# EasyEDA Pro project ADC前端电路.eprj

# Schematic Schematic1_2
Create Date: 2024-07-14; Page Name: P1; Project Name: ADC前端电路; Schematic Name: Schematic1_2; Update Date: 2024-08-06; Company: 嘉立创EDA; Page Size: A4; Version: V1.0
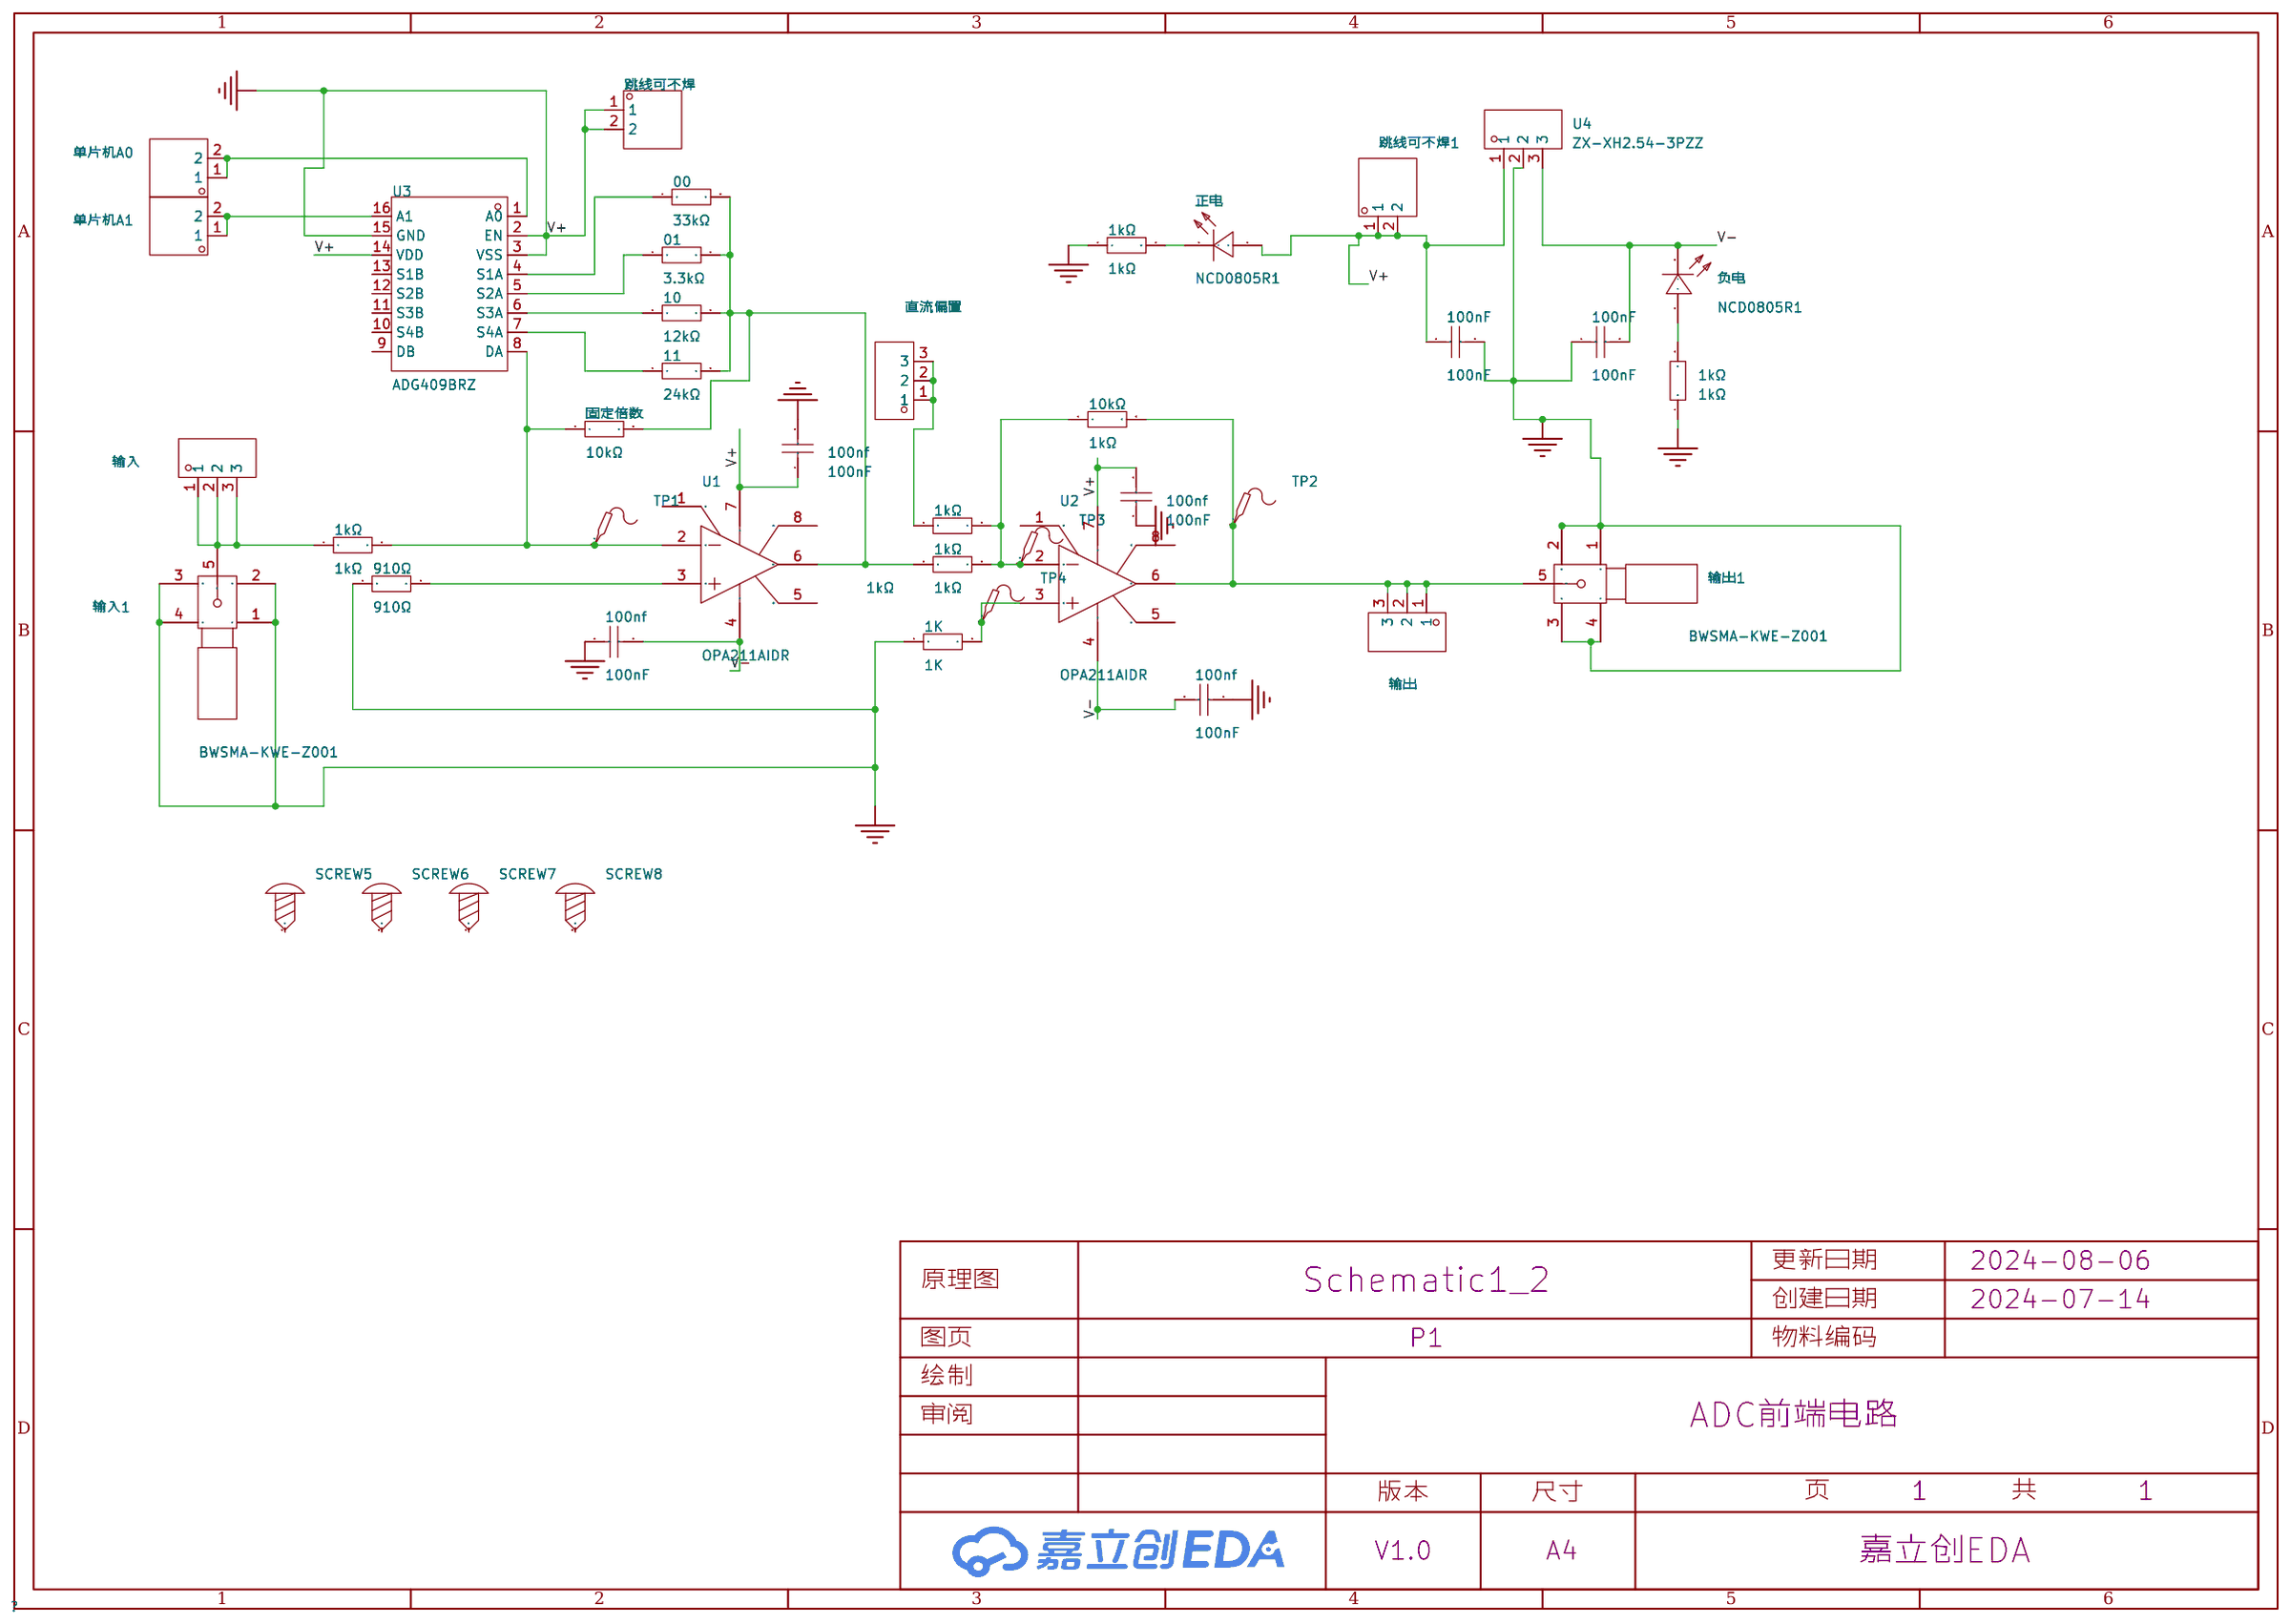
[diagram p0: schematic sheet]

## Parts
00  33kΩ  [R0805]
01  3.3kΩ  [R0805]
1K  1K  [R0805]
1kΩ  1kΩ  [R0805]
1kΩ#2  1kΩ  [R0805]
1kΩ#3  1kΩ  [Res_1/8W]
1kΩ#4  1kΩ  [R0805]
1kΩ#5  1kΩ  [R0805]
10  12kΩ  [R0805]
10kΩ  1kΩ  [Res_1/8W]
11  24kΩ  [R0805]
100nF  100nF  [C0805]
100nf  100nF  [C0805]
100nF#2  100nF  [C0805]
100nf#2  100nF  [C0805]
100nf#3  100nF  [C0805]
100nf#4  100nF  [C0805]
910Ω  910Ω  [R0805]
SCREW5  -  [M3螺丝]
SCREW6  -  [M3螺丝]
SCREW7  -  [M3螺丝]
SCREW8  -  [M3螺丝]
TP1  -  [Test-Point-0.5mm]
TP2  -  [Test-Point-0.5mm]
TP3  -  [Test-Point-0.5mm]
TP4  -  [Test-Point-0.5mm]
U1  OPA211AIDR  [SOIC-8_L4.9-W3.9-P1.27-LS6.0-BL]
U2  OPA211AIDR  [SOIC-8_L4.9-W3.9-P1.27-LS6.0-BL]
U3  ADG409BRZ  [SOIC-16_L9.9-W3.9-P1.27-LS6.0-BL]
U4  ZX-XH2.54-3PZZ  [CONN-TH_3P-P2.54_2501S-3P]
单片机A0  -  [HDR-TH_2P-P2.54-V-M-1]
单片机A1  -  [HDR-TH_2P-P2.54-V-M-1]
固定倍数  10kΩ  [R0805]
正电  NCD0805R1  [LED0805-R-RD]
直流偏置  -  [HDR-TH_3P-P2.54-V-M]
负电  NCD0805R1  [LED0805-R-RD]
跳线可不焊  -  [HDR-TH_2P-P2.54-V-M-1]
跳线可不焊1  -  [HDR-TH_2P-P2.54-V-M-1]
输入  -  [HDR-TH_3P-P2.54-V-F]
输入1  BWSMA-KWE-Z001  [SMA-TH_BWSMA-KWE-Z001]
输出  -  [HDR-TH_3P-P2.54-V-F]
输出1  BWSMA-KWE-Z001  [SMA-TH_BWSMA-KWE-Z001]

## Library data of the parts
00 01 1kΩ 1kΩ#2 1kΩ#4 1kΩ#5 10 11 910Ω 固定倍数 = 0805W8F1002T5E_C17414: 电阻类型:厚膜电阻;阻值:10kΩ;精度:±1%;功率:125mW;最大工作电压:150V;温度系数:±100ppm/℃;; LCSC Part Name: 10kΩ ±1% 125mW 厚膜电阻; Supplier Part: C17414; Manufacturer: UNI-ROYAL(厚声); Manufacturer Part: 0805W8F1002T5E; Supplier Footprint: 0805; JLCPCB Part Class: Basic Part; Datasheet: https://atta.szlcsc.com/upload/public/pdf/source/20200306/C422600_1E6D84923E4A46A82E41ADD87F860B5C.pdf; Supplier: LCSC; Type: 厚膜电阻; Tolerance: ±1%; Power(Watts): 125mW; Overload Voltage (Max): 150V; Temperature Coefficient: ±100ppm/℃; Operating Temperature Range: -55℃~+155℃
1K = Res_0805: Supplier Footprint: 0805
1kΩ#3 10kΩ = Res_AXIAL-1/8W: Supplier Footprint: 轴向引线
100nF 100nf 100nF#2 100nf#2-100nf#4 = CC0805KRX7R9BB104: 容值:100nF;精度:±10%;额定电压:50V;材质(温度系数):X7R;; LCSC Part Name: 100nF ±10% 50V; Supplier Part: C49678; Manufacturer: YAGEO(国巨); Supplier Footprint: 0805; JLCPCB Part Class: 基础库; Datasheet: https://atta.szlcsc.com/upload/public/pdf/source/20180224/C181747_15194369449651363981.pdf; Supplier: LCSC; Tolerance: ±10%; Voltage Rated: 50V; Temperature Coefficient: X7R
SCREW5-SCREW8 = M3螺丝: Supplier Footprint: 插件
TP1-TP4 = Test-Point: Test Point 测试点
U1 U2 = OPA211AIDR: 放大器数:单路;增益带宽积(GBP):80MHz;输入偏置电流(Ib):60nA;压摆率(SR):27V/us;轨到轨:-;; Supplier Part: C523992; Manufacturer: TI(德州仪器); Supplier Footprint: SOIC-8; JLCPCB Part Class: 扩展库; Datasheet: https://www.ti.com/cn/lit/gpn/opa211; Supplier: LCSC; Number of Circuits: 单路; Gain Bandwidth Product(GBP): 80MHz; Current - Input Bias(Ib): 60nA; Slew Rate(SR): 27V/us; Output Current: 30mA; Operating Temperature: -40℃~+125℃
U3 = ADG409BRZ: 开关电路:单刀四掷(SP4T);通道数:2;导通电阻(Ron@VCC):100Ω;; Supplier Part: C209414; Manufacturer: ADI(亚德诺); Supplier Footprint: SOIC-16; JLCPCB Part Class: 扩展库; Datasheet: https://atta.szlcsc.com/upload/public/pdf/source/20190819/C391265_7868ADE2F7ECF1D266CA16051ABDB450.pdf; Supplier: LCSC; Switch Circuit: 单刀四掷(SP4T); Number of Channels: 2; Supply Voltage: 12V; On-State Resistance (Max): 100Ω
U4 = ZX-XH2.54-3PZZ: 插针结构:1x3P;间距:2.54mm;安装方式:直插;参考系列:XH;总PIN数:3P;排数:1;每排PIN数:3;行距:-;额定电流:3A;触头材质:黄铜;触头镀层:锡;工作温度范围:-25℃~+85℃;; Supplier Part: C7429633; Manufacturer: Megastar(兆星); Supplier Footprint: 插件,P=2.54mm; JLCPCB Part Class: 扩展库; Datasheet: https://atta.szlcsc.com/upload/public/pdf/source/20230619/AE17037A2CFDBE8D9CBA775D61AD0A84.pdf; Supplier: LCSC; Pins Structure: 1x3P; Pitch: 2.54mm; Mounting Style: 直插; Reference Series: XH; Number of Pins: 3P; Number of Rows: 1; Number of PINs Per Row: 3; Current Rating (Max): 3A; Contact Material: 黄铜; Contact Plating: 锡; Operating Temperature Range: -25℃~+85℃
单片机A0 单片机A1 跳线可不焊 跳线可不焊1 = HDR-M_2.54_1x2P: Supplier Part: C124375; Supplier Footprint: 插件
正电 负电 = NCD0805R1: 灯头类型:-;发光颜色:红色;正向电压(VF):1.6V~2.6V;功率:65mW;正向电流:20mA;主波长:615nm~630nm;二极管配置:独立二极管;透镜颜色:无色透明透镜;色温:-;发光强度:67mcd~195mcd;发光角度:130°;载带方式:-;工作温度:-30℃~+85℃;; Supplier Part: C84256; Manufacturer: 国星光电; Supplier Footprint: 0805; JLCPCB Part Class: Basic Part; Datasheet: https://atta.szlcsc.com/upload/public/pdf/source/20200820/C84256_F0A75A43B3EAD75808600A0514C76B99.pdf; Supplier: LCSC; Emitted Color: 红色; Forward Voltage (VF): 1.6V~2.6V; Power Dissipation: 65mW; Forward Current: 20mA; Dominant Wavelength: 615nm~630nm; Diode Configuration: 独立二极管; Lens Color: 无色透明透镜; Luminous Intensity: 67mcd~195mcd; Viewing Angle: 130°; Operating Temperature: -30℃~+85℃
直流偏置 = HDR-M_2.54_1x3P: Supplier Part: C2937625; Supplier Footprint: 插件
输入 输出 = HDR-F_2.54_1x3P: Supplier Part: C541850; Supplier Footprint: 插件
输入1 输出1 = BWSMA-KWE-Z001: 连接器类型:板端;接口类型:内孔;端口数量:1;接口直径:5.3mm;接口长度/高度:-;频率-最大值:-;射频系列:SMA;阻抗:50Ω;样式:弯头;触头材质:-;触头镀层:-;工作温度范围:-;焊接温度(最大值):-;; LCSC Part Name: 内孔 SMA 弯头; Supplier Part: C496551; Manufacturer: BAT WIRELESS(蝙蝠无线); Supplier Footprint: 插件; JLCPCB Part Class: 扩展库; Datasheet: https://atta.szlcsc.com/upload/public/pdf/source/20231017/997A8C2ADA7F8034A89BE1264F38CE52.pdf; Supplier: LCSC; Connector Type: 板端; Interface Type: 内孔; Number of Ports: 1; Interface Diameter: 5.3mm; RF Series: SMA; Impedance: 50Ω; Style: 弯头

## Nets
GND: 1K.1 1kΩ#4.1 1kΩ#5.1 100nf.1 100nF.2 100nF#2.1 100nf#2.1 100nf#3.2 100nf#4.2 910Ω.1 U3.3(VSS) U3.15(GND) U4.2 输入1.1 输入1.2 输入1.3 输入1.4 输出1.1 输出1.2 输出1.3 输出1.4
V+: 100nF.1 100nf.2 100nf#3.1 U1.7(V+) U2.7(V+) U3.2(EN) U3.14(VDD) U4.1 正电.1(+) 跳线可不焊.1 跳线可不焊.2 跳线可不焊1.1 跳线可不焊1.2
V-: 100nF#2.2 100nf#2.2 100nf#4.1 U1.4(V-) U2.4(V-) U4.3 负电.2(-)
$1N586: 00.1 U3.4(S1A)
$1N606: 01.1 U3.5(S2A)
$1N610: 10.1 U3.6(S3A)
$1N616: 11.1 U3.7(S4A)
$1N704: 910Ω.2 U1.3(IN+)
$1N929: 1K.2 TP4.1 U2.3(IN+)
$1N2671: U3.1(A0) 单片机A0.1 单片机A0.2
$1N2676: U3.16(A1) 单片机A1.1 单片机A1.2
$1N3075: 10kΩ.2 TP2.1 U2.6(OUT) 输出.1 输出.2 输出.3 输出1.5
Net-(00-2): 00.2 01.2 1kΩ#3.1 10.2 11.2 U1.6(OUT) 固定倍数.2
Net-(1kΩ#2-1): 1kΩ#2.1 直流偏置.1 直流偏置.2 直流偏置.3
Net-(1kΩ#2-2): 1kΩ#2.2 1kΩ#3.2 10kΩ.1 TP3.1 U2.2(IN-)
Net-(1kΩ#4-2): 1kΩ#4.2 正电.2(-)
Net-(1kΩ#5-2): 1kΩ#5.2 负电.1(+)
Net-(1kΩ-1): 1kΩ.1 输入.1 输入.2 输入.3 输入1.5
Net-(1kΩ-2): 1kΩ.2 TP1.1 U1.2(IN-) U3.8(DA) 固定倍数.1

Not connected (* = marked no-connect by the designer): SCREW5 1; SCREW6 1; SCREW7 1; SCREW8 1; U1 1(NC) 5(NC) 8(NC); U2 1(NC) 5(NC) 8(NC); U3 9(DB) 10(S4B) 11(S3B) 12(S2B) 13(S1B)

# Board PCB1_2
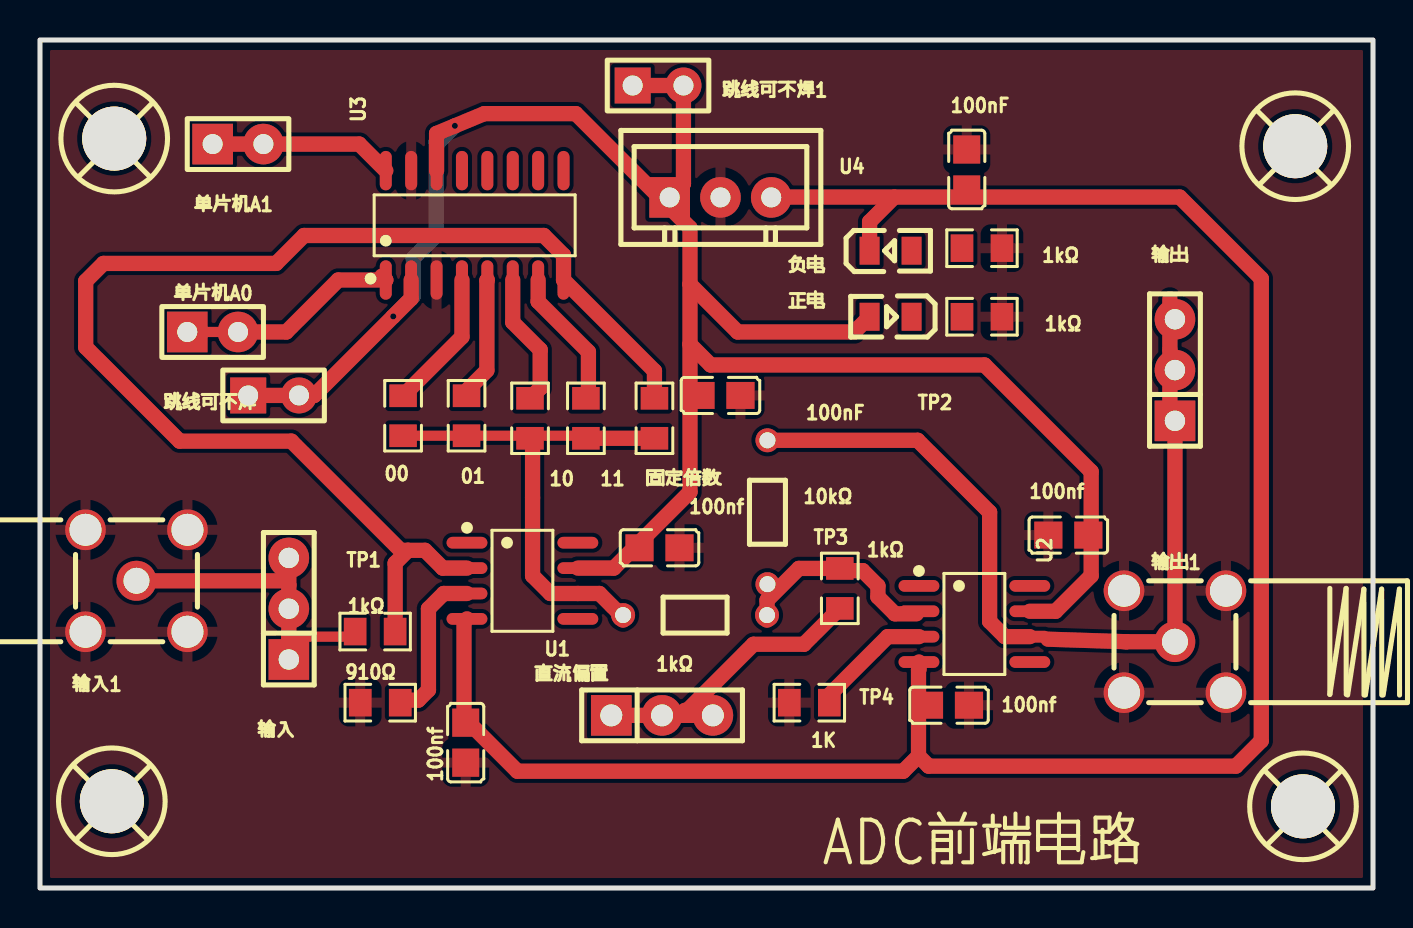
[diagram p1: board, top side]
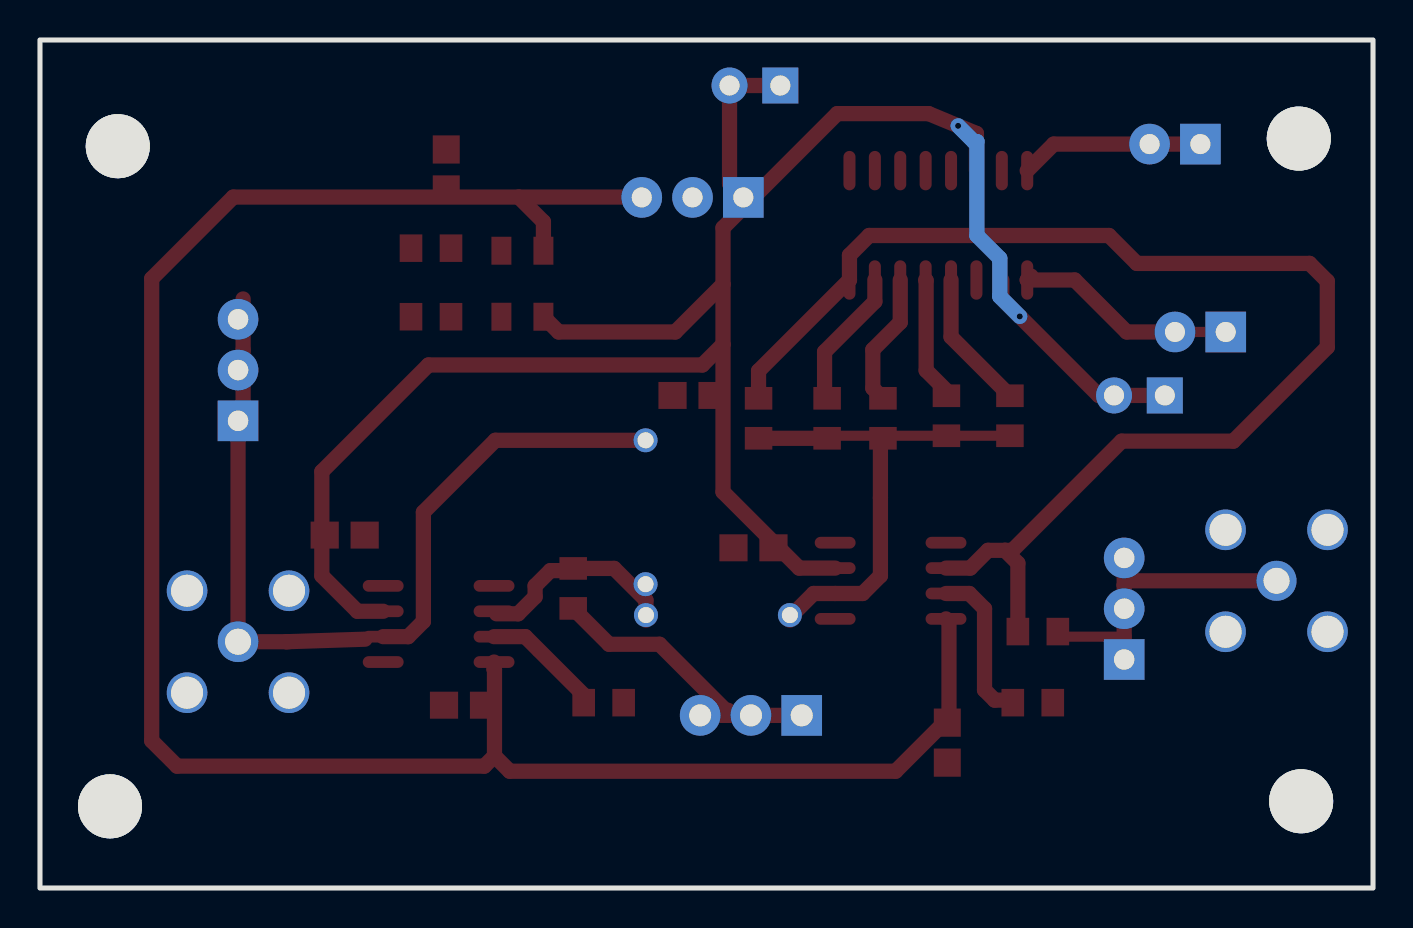
[diagram p2: board, bottom side, seen from below]

Outline 66.68 x 42.42 mm; copper layers: Top Layer, Bottom Layer. Coordinates in mm from the lower left corner of the outline.
Outline path: rectangle 0,42.42 66.68,0
Stack: Top Layer 0.035mm / Dielectric1 1.51mm FR4 er 4.5 / Bottom Layer 0.035mm

## Design rules (mm)
template: 自定义配置
spacing copperThickness1oz (default): track to track 0.102, other pairs 0.152 to 0.3
spacing copperThickness2oz: track to track 0.203, other pairs 0.152 to 0.3
track width copperThickness1oz (default): min 0.127, default 0.254, max 2.54
track width copperThickness2oz: min 0.203, default 0.254, max 2.54
differential pair differentialPair (default): width min 0.127, default 0.254, max 2.54; gap min 0.152, default 0.152
via viaSize (default): diameter min 0.5, default 0.61, max 10; hole min 0.3, default 0.305, max 6.299

## Placement (name value [footprint] x y rotation side)
00  33kΩ  [R0805]  18.16 23.62 270 top
01  3.3kΩ  [R0805]  21.34 23.62 270 top
1K  1K  [R0805]  38.48 9.27 0 top
1kΩ  1kΩ  [R0805]  47.12 28.58 180 top
1kΩ#2  1kΩ  [R0805]  47.12 32 180 top
1kΩ#3  1kΩ  [R0805]  40 14.99 90 top
1kΩ#4  1kΩ  [R0805]  16.76 12.83 0 top
1kΩ#5  1kΩ  [Res_1/8W]  32.77 13.59 0 top
10  12kΩ  [R0805]  24.51 23.5 270 top
10kΩ  1kΩ  [Res_1/8W]  36.45 18.8 90 top
11  24kΩ  [R0805]  27.31 23.5 270 top
100nF  100nF  [C0805]  34.04 24.64 0 top
100nf  100nF  [C0805]  30.99 17.02 180 top
100nF#2  100nF  [C0805]  46.35 35.94 270 top
100nf#2  100nF  [C0805]  21.29 7.27 90 top
100nf#3  100nF  [C0805]  51.44 17.65 180 top
100nf#4  100nF  [C0805]  45.47 9.14 0 top
910Ω  910Ω  [R0805]  17.02 9.27 0 top
NOREF  -  [Pad_e125]  24.64 19.52 0 top
SCREW5  -  [M3螺丝]  63.24 4.02 0 top
SCREW6  -  [M3螺丝]  62.85 37.04 0 top
SCREW7  -  [M3螺丝]  3.66 4.28 0 top
SCREW8  -  [M3螺丝]  3.78 37.42 0 top
TP1  -  [Test-Point-0.5mm]  17.83 15.85 0 top
TP2  -  [Test-Point-0.5mm]  44.07 22.35 0 top
TP3  -  [Test-Point-0.5mm]  37.99 15.99 0 top
TP4  -  [Test-Point-0.5mm]  41.82 11.82 0 top
U1  OPA211AIDR  [SOIC-8_L4.9-W3.9-P1.27-LS6.0-BL]  24.13 15.37 270 top
U2  OPA211AIDR  [SOIC-8_L4.9-W3.9-P1.27-LS6.0-BL]  46.74 13.21 270 top
U3  ADG409BRZ  [SOIC-16_L9.9-W3.9-P1.27-LS6.0-BL]  21.74 33.15 0 top
U4  ZX-XH2.54-3PZZ  [conn-th_3p-p2.54_2501s-3p]  34.04 34.54 0 top
单片机A0  -  [hdr-th_2p-p2.54-v-m-1]  8.64 27.81 0 top
单片机A1  -  [hdr-th_2p-p2.54-v-m-1]  9.91 37.21 0 top
固定倍数  10kΩ  [R0805]  30.73 23.5 270 top
正电  NCD0805R1  [LED0805-R-RD]  42.54 28.58 180 top
直流偏置  -  [hdr-th_3p-p2.54-v-m]  31.12 8.64 0 top
负电  NCD0805R1  [LED0805-R-RD]  42.54 31.88 0 top
跳线可不焊  -  [HDR-TH_2P-P2.54-V-M-1]  11.68 24.64 0 top
跳线可不焊1  -  [HDR-TH_2P-P2.54-V-M-1]  30.91 40.14 0 top
输入  -  [hdr-th_3p-p2.54-v-f]  12.45 13.97 90 top
输入1  BWSMA-KWE-Z001  [sma-th_bwsma-kwe-z001#2]  4.83 15.37 180 top
输出  -  [hdr-th_3p-p2.54-v-f]  56.77 25.91 90 top
输出1  BWSMA-KWE-Z001  [sma-th_bwsma-kwe-z001]  56.77 12.32 0 top

## Footprints (pads in the part's own frame, mm; a bottom-side part is the same pattern mirrored in y, then rotated)
C0805
  rect 1.41x1.35 smd: 1(-1,0) 2(1,0)
conn-th_3p-p2.54_2501s-3p
  rect 2.032x2.032 hole 1x0.762: 1(-2.54,0)
  round 2.032 hole 1x0.762: 2(0,0) 3(2.54,0)
hdr-th_2p-p2.54-v-m-1
  rect 2.032x2.032 hole 1x0.762: 1(-1.27,0)
  round 2.032 hole 1x0.762: 2(1.27,0)
HDR-TH_2P-P2.54-V-M-1
  rect 1.8x1.8 hole 1: 1(-1.27,0)
  round 1.8 hole 1: 2(1.27,0)
hdr-th_3p-p2.54-v-f
  rect 2.032x2.032 hole 1.02x0.762: 1(-2.54,0)
  round 2.032 hole 1.02x0.762: 2(0,0) 3(2.54,0)
hdr-th_3p-p2.54-v-m
  rect 2.032x2.032 hole 1.1x0.762: 1(-2.54,0)
  round 2.032 hole 1.1x0.762: 2(0,0) 3(2.54,0)
LED0805-R-RD
  rect 1x1.399 smd: 1(1.05,0) 2(-1.05,0)
M3螺丝
  round 3.2 hole 3.2: 1(-0.064,0.064)
Pad_e125
  round 0.61 smd: TP1(0,0)
R0805
  rect 1.133x1.377 smd: 1(-1,0) 2(1,0)
Res_1/8W
  round 1.199 hole 0.8: 1(-3.599,0.063) 2(3.599,0.063)
sma-th_bwsma-kwe-z001
  round 2.032 hole 1.6x0.762: 1(-2.55,-2.55) 2(-2.55,2.55) 3(2.55,2.55) 4(2.55,-2.55)
  round 2.032 hole 1.3x0.762: 5(0,0)
sma-th_bwsma-kwe-z001#2
  round 2.032 hole 1.6x0.762: 1(-2.55,-2.55) 2(-2.55,2.55) 3(2.55,2.55) 4(2.55,-2.55)
  round 2 hole 1.3: 5(0,0)
SOIC-8_L4.9-W3.9-P1.27-LS6.0-BL
  oval 0.588x2.045 smd: 1(-1.905,-2.772) 2(-0.635,-2.772) 3(0.635,-2.772) 4(1.905,-2.772) 5(1.905,2.772) 6(0.635,2.772) 7(-0.635,2.772) 8(-1.905,2.772)
SOIC-16_L9.9-W3.9-P1.27-LS6.0-BL
  oval 0.602x1.971 smd: 1(-4.445,-2.736) 2(-3.175,-2.736) 3(-1.905,-2.736) 4(-0.635,-2.736) 5(0.635,-2.736) 6(1.905,-2.736) 7(3.175,-2.736) 8(4.445,-2.736) 9(4.445,2.736) 10(3.175,2.736) 11(1.905,2.736) 12(0.635,2.736) 13(-0.635,2.736) 14(-1.905,2.736) 15(-3.175,2.736) 16(-4.445,2.736)
Test-Point-0.5mm
  round 0.5 smd: 1(0,0)

## Nets
GND: 1K.1 1kΩ.1 1kΩ#2.1 100nf.1 100nF.2 100nF#2.1 100nf#2.1 100nf#3.2 100nf#4.2 910Ω.1 U3.3 U3.15 U4.2 输入1.1 输入1.2 输入1.3 输入1.4 输出1.1 输出1.2 输出1.3 输出1.4
V+: 100nF.1 100nf.2 100nf#3.1 U1.7 U2.7 U3.2 U3.14 U4.1 正电.1 跳线可不焊.1 跳线可不焊.2 跳线可不焊1.1 跳线可不焊1.2
V-: 100nF#2.2 100nf#2.2 100nf#4.1 U1.4 U2.4 U4.3 负电.2
$1N586: 00.1 U3.4
$1N606: 01.1 U3.5
$1N610: 10.1 U3.6
$1N616: 11.1 U3.7
$1N704: 910Ω.2 U1.3
$1N798: 1kΩ#4.1 输入.1 输入.2 输入.3 输入1.5
$1N929: 1K.2 TP4.1 U2.3
$1N2671: U3.1 单片机A0.1 单片机A0.2
$1N2676: U3.16 单片机A1.1 单片机A1.2
$1N3075: 10kΩ.2 TP2.1 U2.6 输出.1 输出.2 输出.3 输出1.5
$1N3921: 1kΩ#3.1 直流偏置.1 直流偏置.2 直流偏置.3
$1N4053: 1kΩ#3.2 1kΩ#5.2 10kΩ.1 TP3.1 U2.2
$1N8893: 1kΩ#4.2 TP1.1 U1.2 U3.8 固定倍数.1
$1N8906: 00.2 01.2 1kΩ#5.1 10.2 11.2 NOREF.TP1 U1.6 固定倍数.2
$1N9133: 1kΩ.2 正电.2
$1N9489: 1kΩ#2.2 负电.1

Pads without a net: SCREW5 1; SCREW6 1; SCREW7 1; SCREW8 1; U1 1 5 8; U2 1 5 8; U3 9 10 11 12 13

## Via types
v1: diameter 0.61, hole 0.305, Top Layer to Bottom Layer, 2 vias

## Routing (per net, layer and track width the routed paths; a pad name or vN(x,y) marks a point on that pad's centre or on a via; arc(x,y) is an arc through that point)
V+: length 109.9
  Top Layer w0.762: 32.51,30.2 34.9,27.81 40.73,27.81 正电.1 ; 32.51,30.2 32.51,33.02 26.8,38.73 22.22,38.73 v1(20.75,38.12) 19.84,37.74 U3.14 ; 32.51,30.2 32.51,27.19 ; U2.7 50.8,13.84 52.58,15.62 52.58,20.83 47.24,26.16 33.54,26.16 32.51,27.19 ; U4.1 32.19,35.23 跳线可不焊1.2 跳线可不焊1.1 ; U1.7 28.7,16 32.51,19.81 32.51,27.19 ; 跳线可不焊.1 跳线可不焊.2 13.72,24.64 v1(17.67,28.59) 18.57,29.49 U3.2
  Bottom Layer w0.762: v1(20.75,38.12) 19.97,37.34 19.81,37.34 19.81,32.64 18.67,31.5 18.67,29.59 v1(17.67,28.59)
V-: length 104.3
  Top Layer w0.762: U4.3 36.59,34.56 42.73,34.56 ; 42.73,34.56 41.49,33.33 负电.2 ; 42.73,34.56 57.01,34.56 61.09,30.48 61.09,7.37 59.82,6.1 44.45,6.1 43.94,6.6 ; U2.4 43.96,10.94 43.94,10.92 43.94,6.6 ; 43.94,6.6 43.18,5.84 23.88,5.84 21.21,8.51 21.21,13.31 U1.4
$1N586: length 7
  Top Layer w0.762: 00.1 21.11,27.57 U3.4
$1N606: length 6.3
  Top Layer w0.762: 01.1 21.21,24.75 22.35,25.89 22.35,30.39 U3.5
$1N610: length 6.7
  Top Layer w0.762: U3.6 23.65,28.3 25.02,26.92 25.02,25 10.1
$1N616: length 7
  Top Layer w0.762: U3.7 24.92,29.33 27.43,26.82 27.43,24.62 11.1
$1N704: length 8.1
  Top Layer w0.762: 17.89,9.4 18.92,9.4 19.43,9.91 19.43,13.97 20.19,14.73 U1.3
$1N798: length 16.7
  Top Layer w0.508: 12.45,12.57 15.51,12.57 1kΩ#4.1 ; 12.45,11.43 12.95,11.43
  Top Layer w0.762: 输入1.5 12.23,15.37 12.45,15.15 ; 12.45,15.15 输入.2 12.45,11.43 ; 12.45,15.15 输入.3
$1N929: length 6.1
  Top Layer w0.762: U2.3 42.4,12.57 39.48,9.66 1K.2
$1N2671: length 11.3
  Top Layer w0.508: 单片机A0.1 单片机A0.2
  Top Layer w0.762: 单片机A0.2 12.32,27.81 14.92,30.41 U3.1 17.1,30.61
$1N2676: length 9.2
  Top Layer w0.762: 8.64,37.21 15.97,37.21 U3.16
$1N3075: length 43
  Top Layer w0.762: 56.52,24.38 56.52,29.46 ; 54.23,12.32 54.36,12.32 ; 54.36,12.32 50.42,12.45 ; 54.36,12.32 输出1.5 输出.1 ; 10kΩ.2 43.9,22.4 47.5,18.8 47.5,13.34 48.26,12.57 U2.6
$1N3921: length 15.1
  Top Layer w0.762: 32.26,8.89 32.26,8.76 35.69,12.19 38.21,12.19 1kΩ#3.1 ; 直流偏置.3 直流偏置.2 直流偏置.1
$1N4053: length 10.4
  Top Layer w0.762: 36.37,13.4 36.37,14.39 37.96,15.99 1kΩ#3.2 40.12,15.88 41.15,15.88 41.91,15.11 41.91,14.56 42.76,13.72 43.84,13.72
$1N8893: length 65.6
  Top Layer w0.762: 18.41,16.89 18.03,16.89 12.57,22.35 6.98,22.35 2.29,27.05 2.29,30.35 3.17,31.24 11.81,31.24 13.21,32.64 25.2,32.64 26.19,31.65 U3.8 30.73,25.87 固定倍数.1 ; 18.41,16.89 19.26,16.89 20.14,16 U1.2 ; 18.41,16.89 17.76,16.25 1kΩ#4.2
$1N8906: length 25.1
  Top Layer w0.508: 00.2 01.2 27.18,22.62 11.2
  Top Layer w0.762: 固定倍数.2 11.2 ; 29.17,13.4 29.12,13.44 29.12,13.59 27.98,14.73 U1.6 25.53,14.73 24.64,15.62 NOREF.TP1 24.64,22.37 10.2

## Copper pours and planes (outline as drawn; the poured copper is in the pictures)
GND on Top Layer: 0,42.42 66.68,42.42 66.68,0 0,0

## Text on the board
Top Layer: adg409的2和14加排针的条件下是腐蚀板，不加是pcb
Top Silkscreen Layer: ADC前端电路
